# EAGLE design MotorController_ToniDove_Full06 (EAGLE 6.5.0)
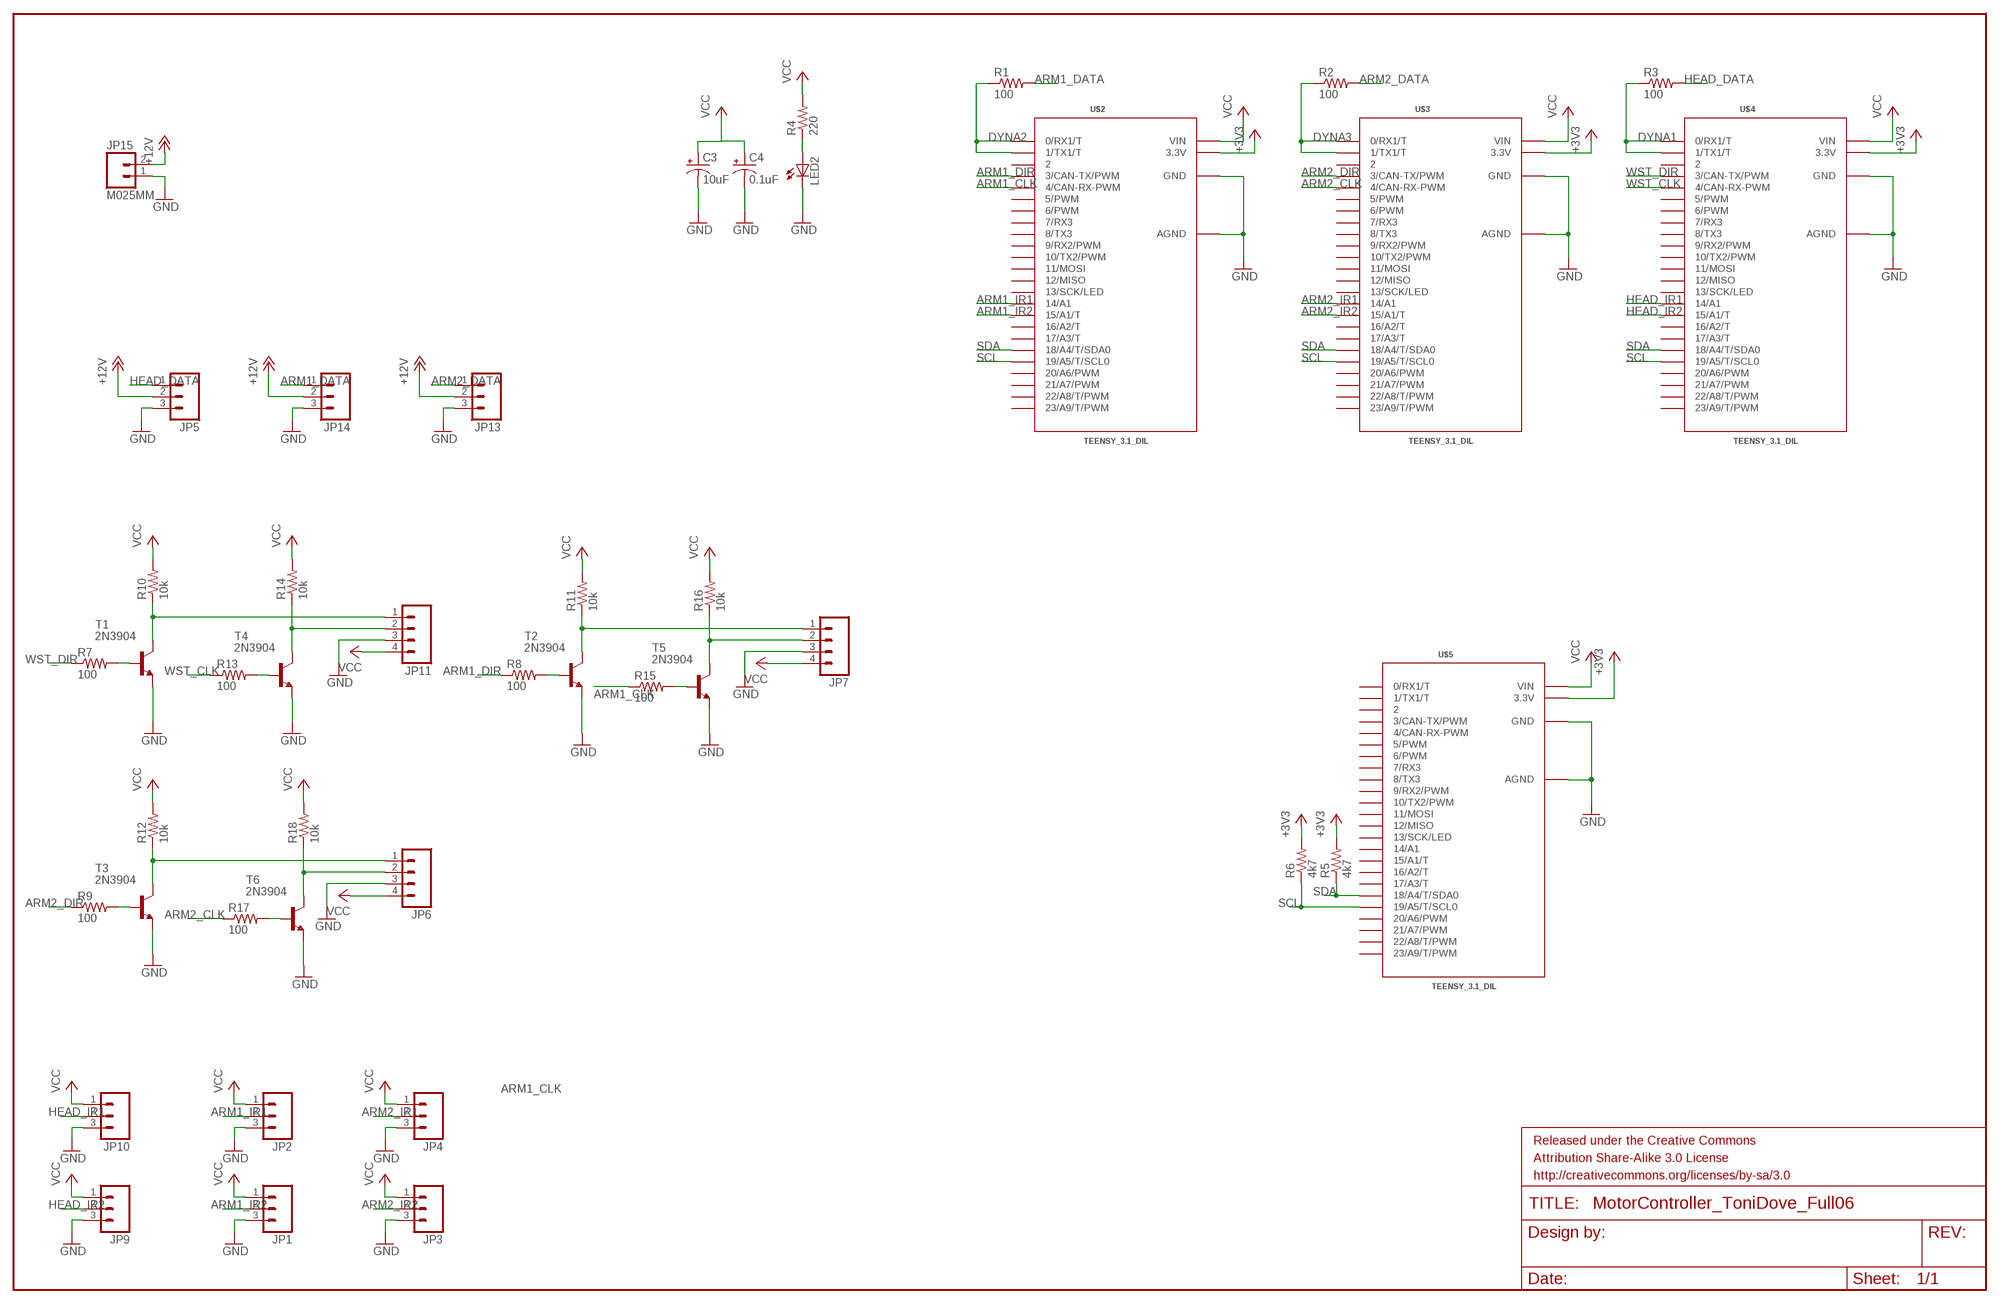
[diagram p0: schematic, sheet 1]

## Parts
C3  10uF  CPOL-USE2,5-6E  [E2,5-6E]
C4  0.1uF  CPOL-USE2,5-6E  [E2,5-6E]
FRAME1  FRAME-LEDGER  [CREATIVE_COMMONS]
JP1  M03PTH  [1X03]
JP2  M03PTH  [1X03]
JP3  M03PTH  [1X03]
JP4  M03PTH  [1X03]
JP5  M03PTH  [1X03]
JP6  M04SCREW  [SCREWTERMINAL-3.5MM-4]
JP7  M04SCREW  [SCREWTERMINAL-3.5MM-4]
JP9  M03PTH  [1X03]
JP10  M03PTH  [1X03]
JP11  M04SCREW  [SCREWTERMINAL-3.5MM-4]
JP13  M03PTH  [1X03]
JP14  M03PTH  [1X03]
JP15  M025MM  [SCREWTERMINAL-5MM-2]
LED2  LED5MM  [LED5MM]
R1  100  R-US_0204/7  [0204/7]
R2  100  R-US_0204/7  [0204/7]
R3  100  R-US_0204/7  [0204/7]
R4  220  R-US_0204/7  [0204/7]
R5  4k7  R-US_0204/7  [0204/7]
R6  4k7  R-US_0204/7  [0204/7]
R7  100  R-US_0204/7  [0204/7]
R8  100  R-US_0204/7  [0204/7]
R9  100  R-US_0204/7  [0204/7]
R10  10k  R-US_0204/7  [0204/7]
R11  10k  R-US_0204/7  [0204/7]
R12  10k  R-US_0204/7  [0204/7]
R13  100  R-US_0204/7  [0204/7]
R14  10k  R-US_0204/7  [0204/7]
R15  100  R-US_0204/7  [0204/7]
R16  10k  R-US_0204/7  [0204/7]
R17  100  R-US_0204/7  [0204/7]
R18  10k  R-US_0204/7  [0204/7]
T1  2N3904  [TO92]
T2  2N3904  [TO92]
T3  2N3904  [TO92]
T4  2N3904  [TO92]
T5  2N3904  [TO92]
T6  2N3904  [TO92]
U$2  TEENSY_3.1_DIL  [TEENSY3-DIL]
U$3  TEENSY_3.1_DIL  [TEENSY3-DIL]
U$4  TEENSY_3.1_DIL  [TEENSY3-DIL]
U$5  TEENSY_3.1_DIL  [TEENSY3-DIL]

## Nets
+3V3: R5.2 R6.2 U$2.3.3V U$3.3.3V U$4.3.3V U$5.3.3V
+12V: JP5.2 JP13.2 JP14.2 JP15.2
ARM1_CLK: R15.1 U$2.4(4/CAN-RX-PWM)
ARM1_DATA: JP14.1 R1.2
ARM1_DIR: R8.1 U$2.3(3/CAN-TX/PWM)
ARM1_IR1: JP2.2 U$2.14/A0(14/A1)
ARM1_IR2: JP1.2 U$2.15/A1(15/A1/T)
ARM2_CLK: R17.1 U$3.4(4/CAN-RX-PWM)
ARM2_DATA: JP13.1 R2.2
ARM2_DIR: R9.1 U$3.3(3/CAN-TX/PWM)
ARM2_IR1: JP4.2 U$3.14/A0(14/A1)
ARM2_IR2: JP3.2 U$3.15/A1(15/A1/T)
DYNA1: R3.1 U$4.0(0/RX1/T) U$4.1(1/TX1/T)
DYNA2: R1.1 U$2.0(0/RX1/T) U$2.1(1/TX1/T)
DYNA3: R2.1 U$3.0(0/RX1/T) U$3.1(1/TX1/T)
GND: C3.- C4.- JP1.3 JP2.3 JP3.3 JP4.3 JP5.3 JP6.3 JP7.3 JP9.3 JP10.3 JP11.3 JP13.3 JP14.3 JP15.1 LED2.K(C) T1.3(E) T2.3(E) T3.3(E) T4.3(E) T5.3(E) T6.3(E) U$2.AGND U$2.GND U$3.AGND U$3.GND U$4.AGND U$4.GND U$5.AGND U$5.GND
HEAD_DATA: JP5.1 R3.2
HEAD_IR1: JP10.2 U$4.14/A0(14/A1)
HEAD_IR2: JP9.2 U$4.15/A1(15/A1/T)
N$2: LED2.A R4.1
N$6: R13.2 T4.2(B)
N$7: R7.2 T1.2(B)
N$8: R8.2 T2.2(B)
N$9: R9.2 T3.2(B)
N$10: JP11.1 R10.1 T1.1(C)
N$11: JP7.1 R11.1 T2.1(C)
N$12: JP6.1 R12.1 T3.1(C)
N$13: JP11.2 R14.1 T4.1(C)
N$14: R15.2 T5.2(B)
N$15: JP7.2 R16.1 T5.1(C)
N$16: R17.2 T6.2(B)
N$17: JP6.2 R18.1 T6.1(C)
SCL: R6.1 U$2.19/A5(19/A5/T/SCL0) U$3.19/A5(19/A5/T/SCL0) U$4.19/A5(19/A5/T/SCL0) U$5.19/A5(19/A5/T/SCL0)
SDA: R5.1 U$2.18/A4(18/A4/T/SDA0) U$3.18/A4(18/A4/T/SDA0) U$4.18/A4(18/A4/T/SDA0) U$5.18/A4(18/A4/T/SDA0)
VCC: C3.+ C4.+ JP1.1 JP2.1 JP3.1 JP4.1 JP6.4 JP7.4 JP9.1 JP10.1 JP11.4 R4.2 R10.2 R11.2 R12.2 R14.2 R16.2 R18.2 U$2.VIN U$3.VIN U$4.VIN U$5.VIN
WST_CLK: R13.1 U$4.4(4/CAN-RX-PWM)
WST_DIR: R7.1 U$4.3(3/CAN-TX/PWM)
Unconnected: U$2.2 U$2.5(5/PWM) U$2.6(6/PWM) U$2.7(7/RX3) U$2.8(8/TX3) U$2.9(9/RX2/PWM) U$2.10(10/TX2/PWM) U$2.11(11/MOSI) U$2.12(12/MISO) U$2.13(13/SCK/LED) U$2.16/A2(16/A2/T) U$2.17/A3(17/A3/T) U$2.20/A6(20/A6/PWM) U$2.21/A7(21/A7/PWM) U$2.22/A8(22/A8/T/PWM) U$2.23/A9(23/A9/T/PWM) U$3.2 U$3.5(5/PWM) U$3.6(6/PWM) U$3.7(7/RX3) U$3.8(8/TX3) U$3.9(9/RX2/PWM) U$3.10(10/TX2/PWM) U$3.11(11/MOSI) U$3.12(12/MISO) U$3.13(13/SCK/LED) U$3.16/A2(16/A2/T) U$3.17/A3(17/A3/T) U$3.20/A6(20/A6/PWM) U$3.21/A7(21/A7/PWM) U$3.22/A8(22/A8/T/PWM) U$3.23/A9(23/A9/T/PWM) U$4.2 U$4.5(5/PWM) U$4.6(6/PWM) U$4.7(7/RX3) U$4.8(8/TX3) U$4.9(9/RX2/PWM) U$4.10(10/TX2/PWM) U$4.11(11/MOSI) U$4.12(12/MISO) U$4.13(13/SCK/LED) U$4.16/A2(16/A2/T) U$4.17/A3(17/A3/T) U$4.20/A6(20/A6/PWM) U$4.21/A7(21/A7/PWM) U$4.22/A8(22/A8/T/PWM) U$4.23/A9(23/A9/T/PWM) U$5.0(0/RX1/T) U$5.1(1/TX1/T) U$5.2 U$5.3(3/CAN-TX/PWM) U$5.4(4/CAN-RX-PWM) U$5.5(5/PWM) U$5.6(6/PWM) U$5.7(7/RX3) U$5.8(8/TX3) U$5.9(9/RX2/PWM) U$5.10(10/TX2/PWM) U$5.11(11/MOSI) U$5.12(12/MISO) U$5.13(13/SCK/LED) U$5.14/A0(14/A1) U$5.15/A1(15/A1/T) U$5.16/A2(16/A2/T) U$5.17/A3(17/A3/T) U$5.20/A6(20/A6/PWM) U$5.21/A7(21/A7/PWM) U$5.22/A8(22/A8/T/PWM) U$5.23/A9(23/A9/T/PWM)

## Library data of the parts
C3 C4 = rcl:CPOL-US: POLARIZED CAPACITOR, American symbol
FRAME1 = SparkFun-Aesthetics:FRAME-LEDGER: Schematic Frame Standard 11x14 US Ledger frame
JP1-JP5 JP9 JP10 JP13 JP14 = SparkFun-Connectors:M03: Header 3 Standard 3-pin 0.1" header. Use with straight break away headers (SKU : PRT-00116), right angle break away headers (PRT-00553), swiss pins (PRT-00743), machine pins (PRT-00117), and female headers (PRT-00115). Molex polarized connector foot print use with SKU : PRT-08232 with associated crimp pins and housings.
JP6 JP7 JP11 = SparkFun-Connectors:M04: Header 4 Standard 4-pin 0.1" header. Use with straight break away headers (SKU : PRT-00116), right angle break away headers (PRT-00553), swiss pins (PRT-00743), machine pins (PRT-00117), and female headers (PRT-00115). Molex polarized connector foot print use with SKU : PRT-08231 with associated crimp pins and housings. 1MM SMD Version SKU: PRT-10208
JP15 = SparkFun-Connectors:M02: Standard 2-pin 0.1" header. Use with - straight break away headers ( PRT-00116) - right angle break away headers (PRT-00553) - swiss pins (PRT-00743) - machine pins (PRT-00117) - female headers (PRT-00115) Molex polarized connector foot print use with: PRT-08233 with associated crimp pins and housings. 2.54_SCREWTERM for use with PRT-10571. 3.5mm Screw Terminal footprints for PRT-08084 5mm Screw Terminal footprints for use with PRT-08433
LED2 = SparkFun-LED:LED: LEDs Standard schematic elements and footprints for 5mm, 3mm, 1206, and 0603 sized LEDs. 5mm - Spark Fun Electronics SKU : COM-00529 (and others)
R1-R18 = rcl:R-US_: RESISTOR, American symbol
T1-T6 = transistor:2N3904: NPN TRANSISTOR
U$2-U$5 = Teensy_3_and_LC_Series_Boards_v1.1:TEENSY_3.1_DIL: Teensy 3.1 or 3.2 in a DIL Layout.

## Board
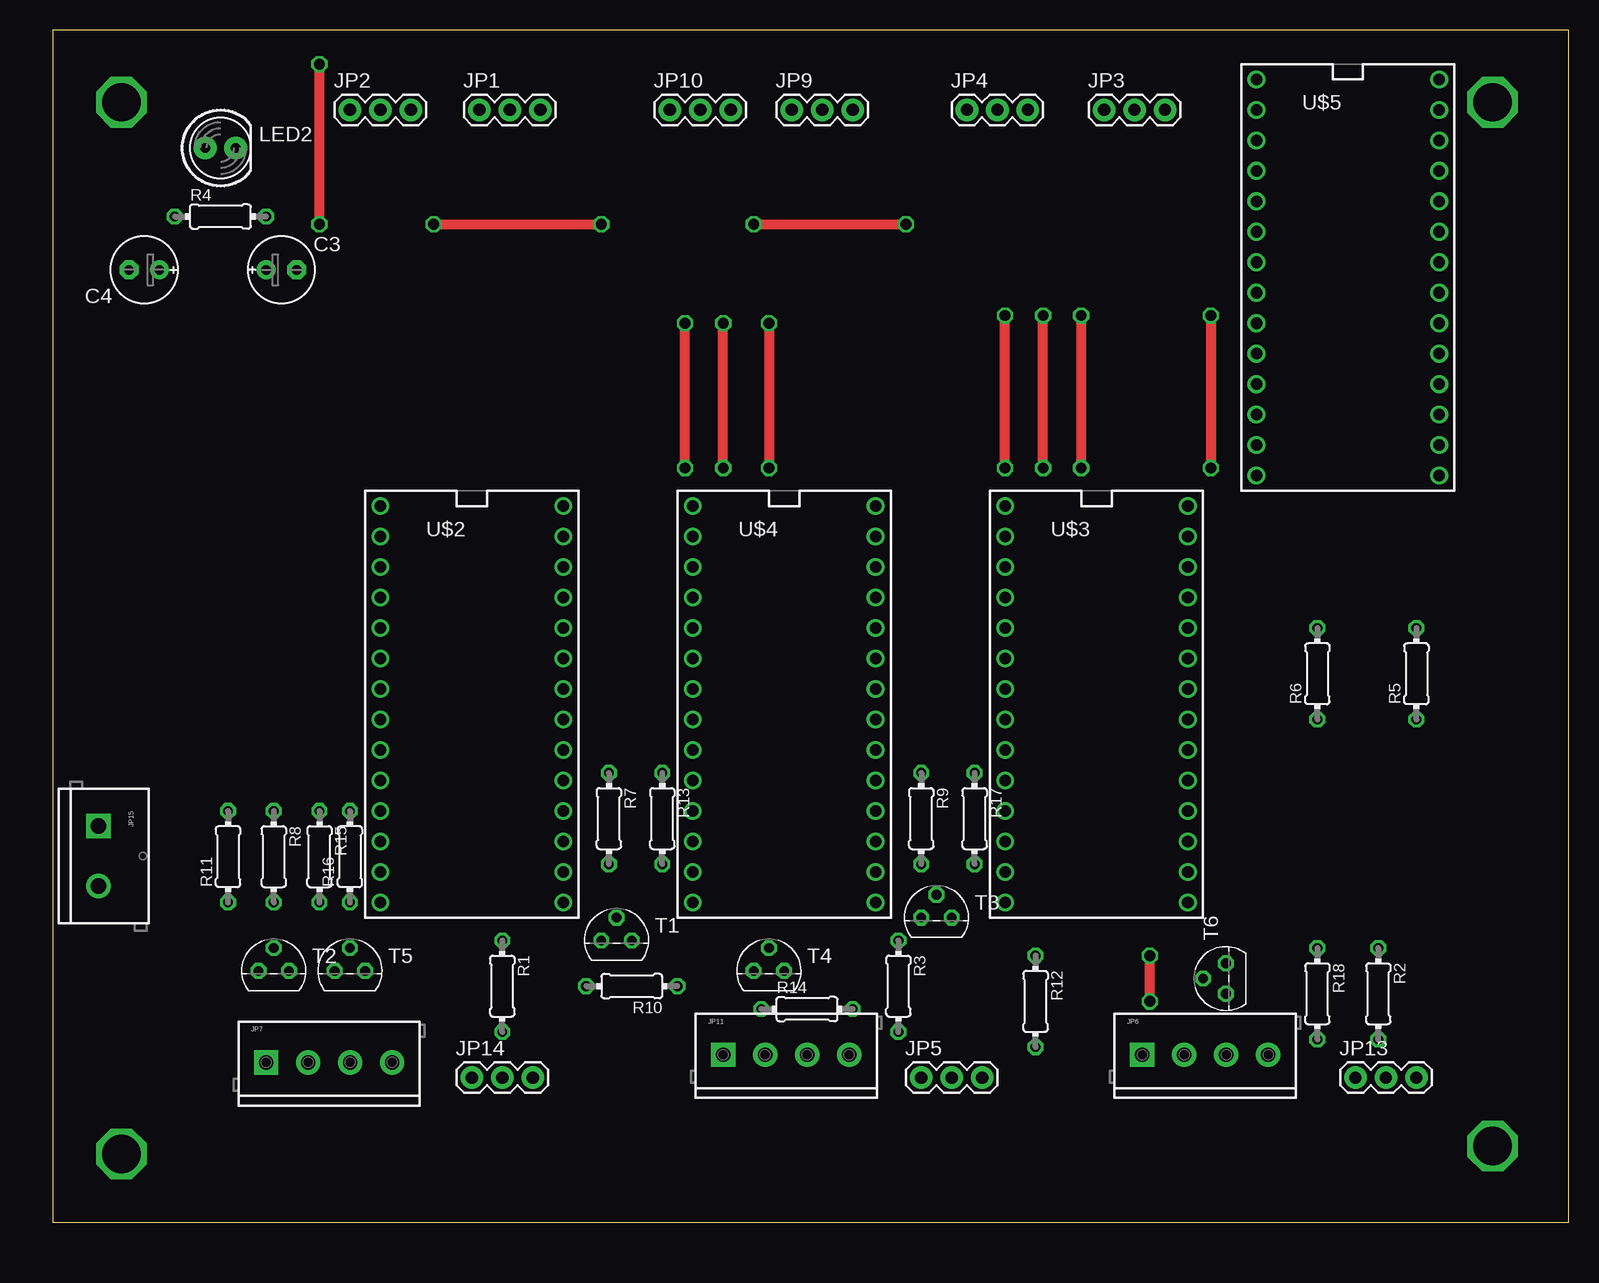
[diagram p1: board, top side]
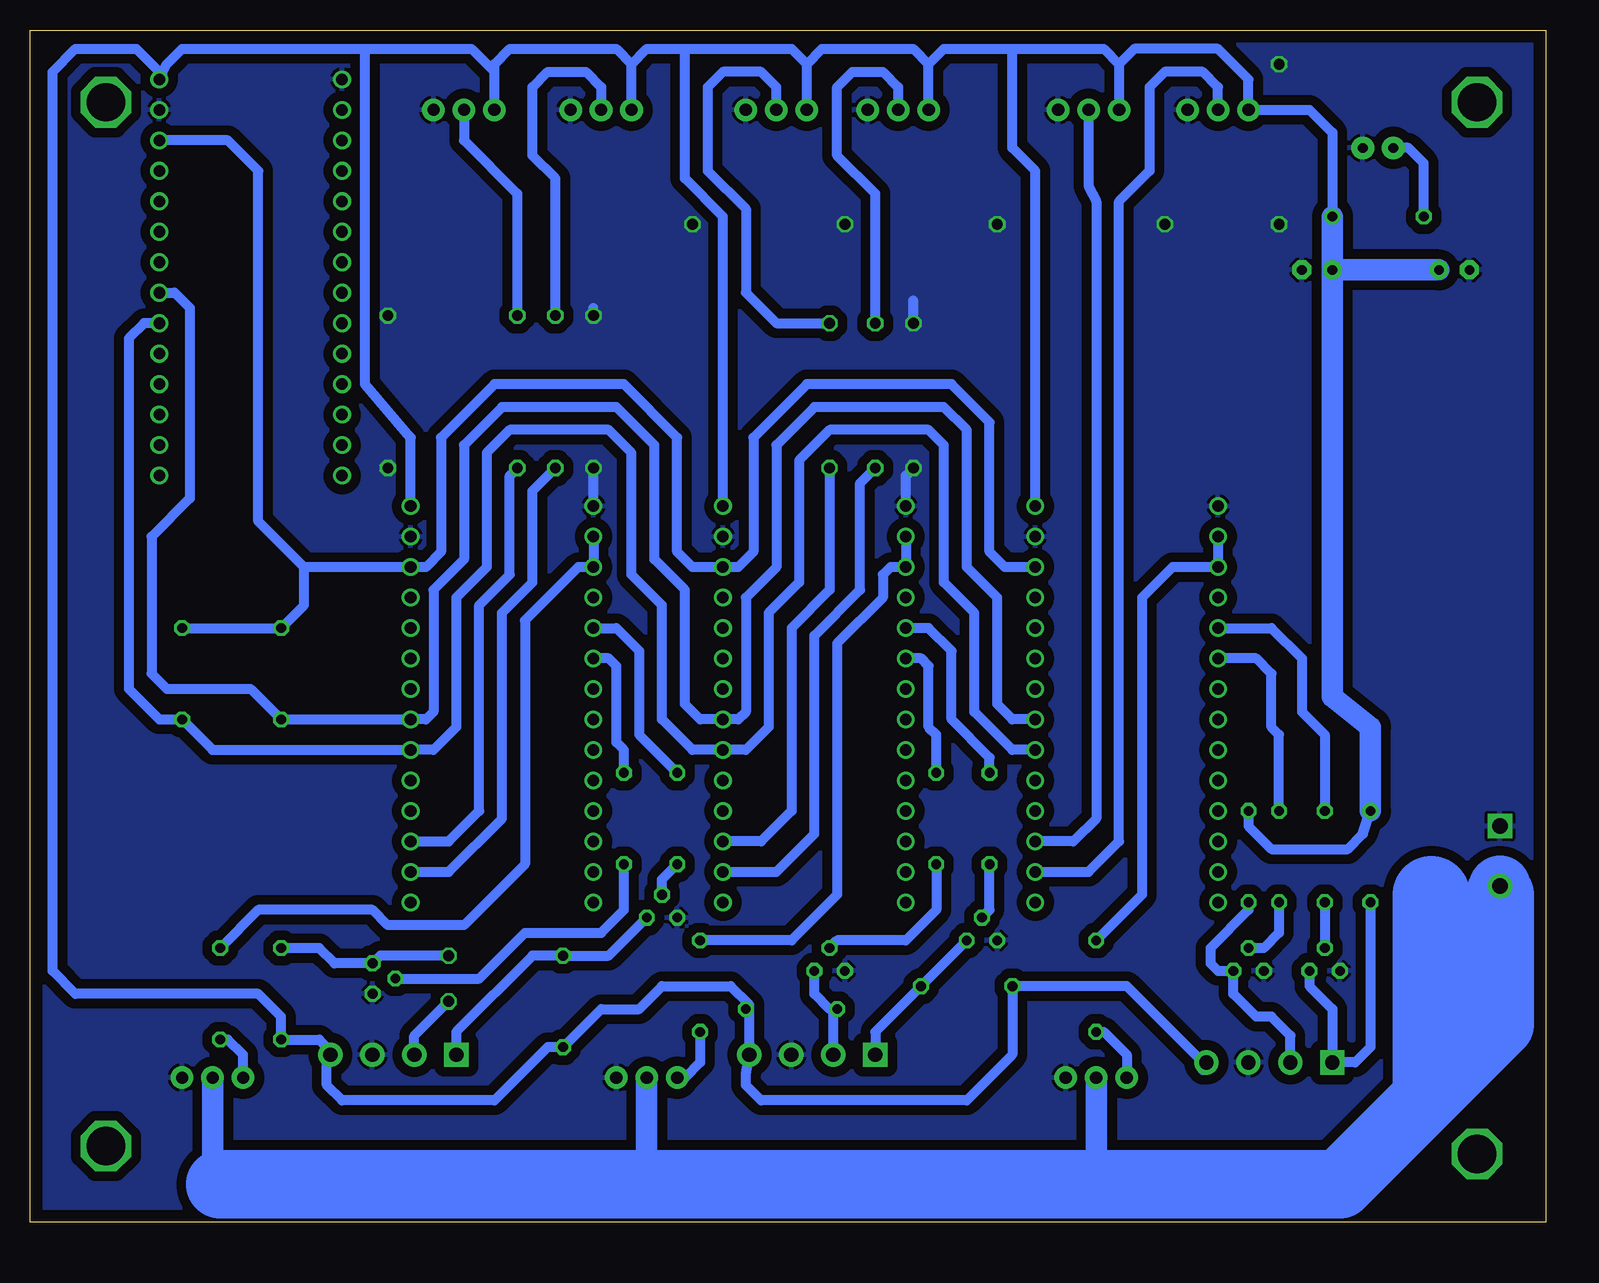
[diagram p2: board, bottom side, seen from below]

Size 126.34 x 99.36 mm. Coordinates in mm from the lower left corner, seen from the top.
Outline: 0,0 126.34,0 126.34,99.36 0,99.36 0,0
Copper layers (1*16): Top 0.035mm / dielectric 1.5mm / Bottom 0.035mm
Design rules "default": minimum track width 10mil, minimum drill 24mil, track to track 8mil, track to pad 8mil, pad to pad 8mil, via to via 8mil, smd to smd 8mil, copper to edge 40mil, drill to drill 8mil, minimum pad ring 10mil, minimum via ring 8mil, stop-mask expansion 4mil, vias tented up to drill 0mil, thermal gap 10mil

### Footprints (pad centres in the part's own frame; a part is rotated, then mirrored left to right if it is on the bottom)
E2,5-6E = drill 0.813 pad 1.575: + -1.27,0 | drill 0.813 pad 1.575 octagon: - 1.27,0
1X03 = drill 1.016 pad 1.88: 1 0,0; 2 2.54,0; 3 5.08,0
SCREWTERMINAL-3.5MM-4 = drill 1.2 pad 2.032 square: 1 0,0 | drill 1.2 pad 2.032: 2 3.5,0; 3 7,0; 4 10.5,0
SCREWTERMINAL-5MM-2 = drill 1.3 pad 2.032 square: 1 0,0 | drill 1.3 pad 2.032: 2 5,0
LED5MM = drill 0.813 pad 1.88: A -1.27,0; K 1.27,0
0204/7 = drill 0.813 octagon: 1 -3.81,0; 2 3.81,0
TO92 = drill 0.813 octagon: 1 1.27,0; 2 0,1.905; 3 -1.27,0
TEENSY3-DIL = drill 0.965: 0 -7.62,13.97; 1 -7.62,11.43; 2 -7.62,8.89; 3 -7.62,6.35; 3.3V 7.62,11.43; 4 -7.62,3.81; 5 -7.62,1.27; 6 -7.62,-1.27; 7 -7.62,-3.81; 8 -7.62,-6.35; 9 -7.62,-8.89; 10 -7.62,-11.43; 11 -7.62,-13.97; 12 -7.62,-16.51; 13 7.62,-16.51; 14/A0 7.62,-13.97; 15/A1 7.62,-11.43; 16/A2 7.62,-8.89; 17/A3 7.62,-6.35; 18/A4 7.62,-3.81; 19/A5 7.62,-1.27; 20/A6 7.62,1.27; 21/A7 7.62,3.81; 22/A8 7.62,6.35; 23/A9 7.62,8.89; AGND 7.62,13.97; GND -7.62,16.51; VIN 7.62,16.51

### Placement (x,y rotation side)
C3  19.05,79.38 0 top
C4  7.62,79.38 180 top
FRAME1  1.27,-15.88 0 top  (outside the outline)
JP1  35.56,92.71 0 top
JP2  24.76,92.71 0 top
JP3  87.63,92.71 0 top
JP4  76.2,92.71 0 top
JP5  72.39,12.06 0 top
JP6  90.8,13.97 0 top
JP7  17.78,13.34 0 top
JP9  61.59,92.71 0 top
JP10  51.44,92.71 0 top
JP11  55.88,13.97 0 top
JP13  108.58,12.06 0 top
JP14  34.93,12.06 0 top
JP15  3.81,33.02 270 top
LED2  13.97,89.53 0 top
R1  37.47,19.68 270 top
R2  110.49,19.05 270 top
R3  70.48,19.68 270 top
R4  13.97,83.82 0 top
R5  113.66,45.72 90 top
R6  105.41,45.72 90 top
R7  46.36,33.66 270 top
R8  18.41,30.48 270 top
R9  72.39,33.66 270 top
R10  48.26,19.68 180 top
R11  14.61,30.48 90 top
R12  81.91,18.41 270 top
R13  50.8,33.66 270 top
R14  62.87,17.78 0 top
R15  22.22,30.48 270 top
R16  24.76,30.48 90 top
R17  76.83,33.66 270 top
R18  105.41,19.05 270 top
T1  46.99,23.5 0 top
T2  18.41,20.95 0 top
T3  73.66,25.4 0 top
T4  59.69,20.95 0 top
T5  24.76,20.95 0 top
T6  97.79,20.32 90 top
U$2  34.93,43.18 0 top
U$3  86.99,43.18 0 top
U$4  60.96,43.18 0 top
U$5  107.95,78.74 0 top

### Tracks (layer width: path | path; a pad name or v marks a point on that pad's centre or on a via)
+3V3
  Bottom 0.813: U$2.3.3V 45.09,54.61 46.36,55.88 46.36,66.67 49.53,69.85 61.59,69.85 66.04,65.41 66.04,55.88 67.31,54.61 U$4.3.3V 71.12,54.61 72.39,55.88 72.39,65.41 76.83,69.85 87.63,69.85 92.07,65.41 92.07,55.88 93.34,54.61 U$3.3.3V 103.5,54.61 | 103.5,54.61 107.31,58.42 107.31,87.63 109.85,90.17 U$5.3.3V | R5.2 R6.2 103.5,51.44 103.5,54.61
+12V
  Bottom 1.778: 75.56,2.54 74.93,3.17 JP5.2 | JP13.2 111.12,2.54 | JP14.2 37.47,3.81 36.84,3.17 | 26.05,2.56 24.14,2.56 24.13,2.54 24.76,2.54 | 62.25,3.19 62.23,3.17 | 97.8,3.19 97.79,3.17
  Bottom 2.54: 25.41,3.17 26.05,2.56 24.76,2.54 | 97.8,3.19 97.8,2.56 97.79,2.54 | 109.85,3.81 110.49,3.17 110.49,2.54 111.12,2.54
  Bottom 5.08: 3.81,26.75 3.81,27.3 JP15.2 3.89,27.94
  Bottom 5.715: 110.49,3.17 97.79,3.17 74.93,3.17 62.23,3.17 36.84,3.17 25.41,3.17 17.14,3.17 7.94,12.38 | 7.94,12.38 3.81,16.51 3.81,27.3 | 9.53,11.43 7.94,12.38
  Bottom 6.452: 9.53,27.3 9.53,11.43
ARM1_CLK
  Bottom 0.813: R15.1 22.22,40.64 22.86,41.27 22.86,45.72 24.13,46.99 U$2.4
ARM1_DATA
  Bottom 0.813: R1.2 36.83,15.88 34.93,13.97 JP14.1
ARM1_DIR
  Bottom 0.813: U$2.3 22.86,49.53 20.32,46.99 20.32,42.55 18.41,40.64 R8.1
ARM1_IR1
  Bottom 0.813: U$2.14/A0 38.1,29.21 35.56,31.75 35.56,85.09 33.02,87.63 33.02,94.61 31.75,95.89 28.57,95.89 27.3,94.61 JP2.2
ARM1_IR2
  Bottom 0.813: JP1.2 38.1,86.36 37.47,85.09 37.47,33.66 39.37,31.75 U$2.15/A1
ARM2_CLK
  Bottom 0.813: R17.1 76.83,39.37 77.47,40.01 77.47,46.35 78.1,46.99 U$3.4
ARM2_DATA
  Bottom 0.813: JP13.1 108.58,13.97 109.85,15.24 R2.2
ARM2_DIR
  Bottom 0.813: U$3.3 77.47,49.53 75.56,47.62 75.56,40.64 R9.1
ARM2_IR1  (via drill 0.9)
  Top 0.813: v82.55,62.87 v82.55,75.56
  Bottom 0.813: U$3.14/A0 91.44,29.21 86.99,33.66 86.99,50.8 84.45,53.34 84.45,60.96 v82.55,62.87 | v82.55,75.56 82.55,87 84.45,88.9 84.45,94.61 83.18,95.89 80.01,95.89 78.74,94.61 JP4.2
ARM2_IR2  (via drill 0.9)
  Top 0.813: v85.72,62.87 v85.72,75.56
  Bottom 0.813: U$3.15/A1 91.44,31.75 88.9,34.29 88.9,51.44 86.36,53.98 86.36,62.23 v85.72,62.87 | JP3.2 90.17,90.17 85.72,85.72 v85.72,75.56
DYNA1
  Bottom 0.813: U$4.0 U$4.1 54.61,54.61 55.25,53.98 55.25,52.07 59.05,48.26 59.05,27.3 62.87,23.5 R3.1
DYNA2
  Bottom 0.813: U$2.0 U$2.1 31.11,54.61 33.66,52.07 33.66,27.3 R1.1
DYNA3
  Bottom 0.813: U$3.0 U$3.1 80.64,54.61 85.09,50.16 85.09,29.84 90.17,24.77 96.52,24.77 97.79,26.04 107.31,26.04 R2.1
GND  (via drill 0.9)
  Top 0.813: v31.75,83.19 v45.72,83.19 | v96.52,75.56 v96.52,62.87 | v58.42,83.19 v71.12,83.19 | v52.71,62.87 v52.71,74.93 | v79.38,62.87 v79.38,75.56 | v22.22,83.19 v22.22,96.52
  Bottom 0.813: U$4.GND 53.34,62.23 v52.71,62.87 | v52.71,74.93 52.71,76.83 | U$3.GND v79.38,62.87 | v79.38,75.56 79.38,76.2
  pour Bottom (isolate 0.813): -1.27,99.06 127,99.06 126.36,-0.64 -1.27,0
HEAD_DATA
  Bottom 0.813: R3.2 70.48,13.34 71.75,12.06 JP5.1
HEAD_IR1  (via drill 0.9)
  Top 0.813: v55.88,62.87 v55.88,74.93
  Bottom 0.813: U$4.14/A0 64.13,29.21 60.96,32.38 60.96,48.9 57.15,52.7 57.15,61.59 v55.88,62.87 | v55.88,74.93 55.88,85.72 59.05,88.9 59.05,94.61 57.79,95.89 55.25,95.89 53.98,94.61 JP10.2
HEAD_IR2  (via drill 0.9)
  Top 0.813: v59.69,74.93 v59.69,62.87
  Bottom 0.813: JP9.2 64.13,94.61 65.41,95.89 68.58,95.89 69.85,94.61 69.85,87.63 66.67,84.45 66.67,77.47 64.13,74.93 v59.69,74.93 | v59.69,62.87 59.69,52.7 62.87,49.53 62.87,34.29 65.41,31.75 U$4.15/A1
N$1  (via drill 3.2)
  other vias: 5.71,93.34
N$2
  Bottom 0.813: R4.1 10.16,88.27 11.43,89.53 LED2.A
N$3  (via drill 3.2)
  other vias: 5.71,5.71
N$4  (via drill 3.2)
  other vias: 120.02,93.34
N$5  (via drill 3.2)
  other vias: 120.02,6.35
N$6
  Bottom 0.813: R13.2 50.8,26.04 53.34,23.5 59.05,23.5 T4.2
N$7
  Bottom 0.813: T1.2 46.36,26.04 R7.2
N$8
  Bottom 0.813: R8.2 T2.2
N$9
  Bottom 0.813: T3.2 73.66,28.57 R9.2
N$10
  Bottom 0.813: JP11.1 55.88,15.88 R10.1 T1.1
N$11
  Bottom 0.813: R11.1 14.61,14.61 15.88,13.34 JP7.1 17.78,17.78 19.68,19.68 T2.1
N$12
  Bottom 0.813: T3.1 78.1,22.23 R12.1 84.45,22.23 90.8,15.88 JP6.1
N$13
  Bottom 0.813: T4.1 60.96,19.05 59.69,17.78 R14.1 59.38,17.45 JP11.2
N$14
  Bottom 0.813: R15.2 22.22,24.13 23.49,22.86 T5.2
N$15
  Bottom 0.813: R16.1 24.76,26.04 27.94,22.86 27.94,21.59 27.3,20.95 T5.1 26.04,19.05 24.13,17.14 22.86,17.14 21.28,15.56 JP7.2
N$16
  Bottom 0.813: T6.2 88.9,20.32 85.09,24.13 78.74,24.13 76.83,26.04 R17.2
N$17  (via drill 0.9)
  Top 0.813: v91.44,18.41 v91.44,22.23
  Bottom 0.813: R18.1 102.23,22.86 100.96,21.59 T6.1 97.16,22.23 v91.44,22.23 | JP6.2 94.3,15.55 v91.44,18.41
SCL
  Bottom 0.813: U$2.19/A5 44.45,41.91 45.72,43.18 45.72,52.07 48.26,54.61 48.26,66.04 50.16,67.94 60.96,67.94 64.13,64.77 64.13,54.61 66.67,52.07 66.67,42.55 67.31,41.91 U$4.19/A5 70.48,41.91 71.75,43.18 71.75,52.7 74.3,55.24 74.3,64.77 77.47,67.94 86.99,67.94 90.17,64.77 90.17,55.24 92.71,52.7 92.71,42.55 93.34,41.91 U$3.19/A5 R6.1 107.95,44.45 114.93,44.45 116.2,45.72 116.2,57.15 113.03,60.33 113.03,76.2 114.3,77.47 U$5.19/A5
SDA
  Bottom 0.813: U$2.18/A4 44.45,39.37 47.62,42.55 47.62,50.8 50.16,53.34 50.16,64.77 51.44,66.04 59.69,66.04 62.23,63.5 62.23,53.34 64.77,50.8 64.77,41.27 66.67,39.37 U$4.18/A4 71.12,39.37 73.66,41.91 73.66,51.44 76.2,53.98 76.2,64.14 78.1,66.04 86.36,66.04 88.27,64.14 88.27,54.61 90.8,52.07 90.8,41.27 92.71,39.37 U$3.18/A4 111.12,39.37 R5.1 115.57,41.91 118.11,44.45 118.11,73.66 116.84,74.93 U$5.18/A4
VCC
  Bottom 0.813: R4.2 17.78,90.81 19.68,92.71 JP2.1 24.76,95.25 27.3,97.79 34.29,97.79 35.56,96.52 | 35.56,96.52 JP1.1 | JP10.1 51.44,96.52 | 51.44,96.52 50.16,97.79 44.45,97.79 | 44.45,97.79 36.83,97.79 35.56,96.52 | U$2.VIN 42.55,87.63 44.45,89.53 44.45,97.79 | JP9.1 61.59,96.52 | 61.59,96.52 60.33,97.79 52.71,97.79 51.44,96.52 | JP4.1 76.2,96.52 | 76.2,96.52 74.93,97.79 71.75,97.79 | 71.75,97.79 62.87,97.79 61.59,96.52 | JP3.1 87.63,95.89 | 87.63,95.89 87.63,96.52 86.36,97.79 77.47,97.79 76.2,96.52 | U$5.VIN 115.32,95.76 | 115.32,95.76 114.93,96.52 113.66,97.79 98.42,97.79 | 98.42,97.79 89.53,97.79 87.63,95.89 | U$4.VIN 68.58,83.82 71.75,87 71.75,97.79 | U$3.VIN 94.61,65.41 98.42,69.85 98.42,97.79 | 66.38,17.78 JP11.4 66.67,12.4 66.67,11.43 65.41,10.16 48.26,10.16 44.45,13.97 R10.2 34.93,19.68 28.57,13.34 JP7.4 28.57,12.7 | 66.38,17.78 66.38,18.12 67.94,19.68 73.66,19.68 75.56,17.78 78.74,17.78 R12.2 83.18,14.61 87.63,10.16 100.33,10.16 101.6,11.43 101.6,13.04 JP6.4 101.3,14.31 102.23,15.24 R18.2 105.41,17.14 107.31,19.05 122.55,19.05 124.46,20.95 124.46,95.89 122.55,97.79 117.47,97.79 115.44,95.76 115.32,95.76 | R16.2 24.76,33.02 22.86,31.11 16.51,31.11 15.24,32.38 R11.2 | R14.2 66.38,17.78
  Bottom 1.778: C4.+ C3.+ | R4.2 C3.+ | R11.2 14.61,41.27 17.78,43.81 C3.+
WST_CLK
  Bottom 0.813: R13.1 50.8,40.64 51.44,41.27 51.44,46.35 52.07,46.99 U$4.4
WST_DIR
  Bottom 0.813: R7.1 46.36,38.73 49.53,41.91 49.53,47.62 51.44,49.53 U$4.3